# Altium schematic sheet 3KW-139_V1.2SchDoc.SchDoc
size A2
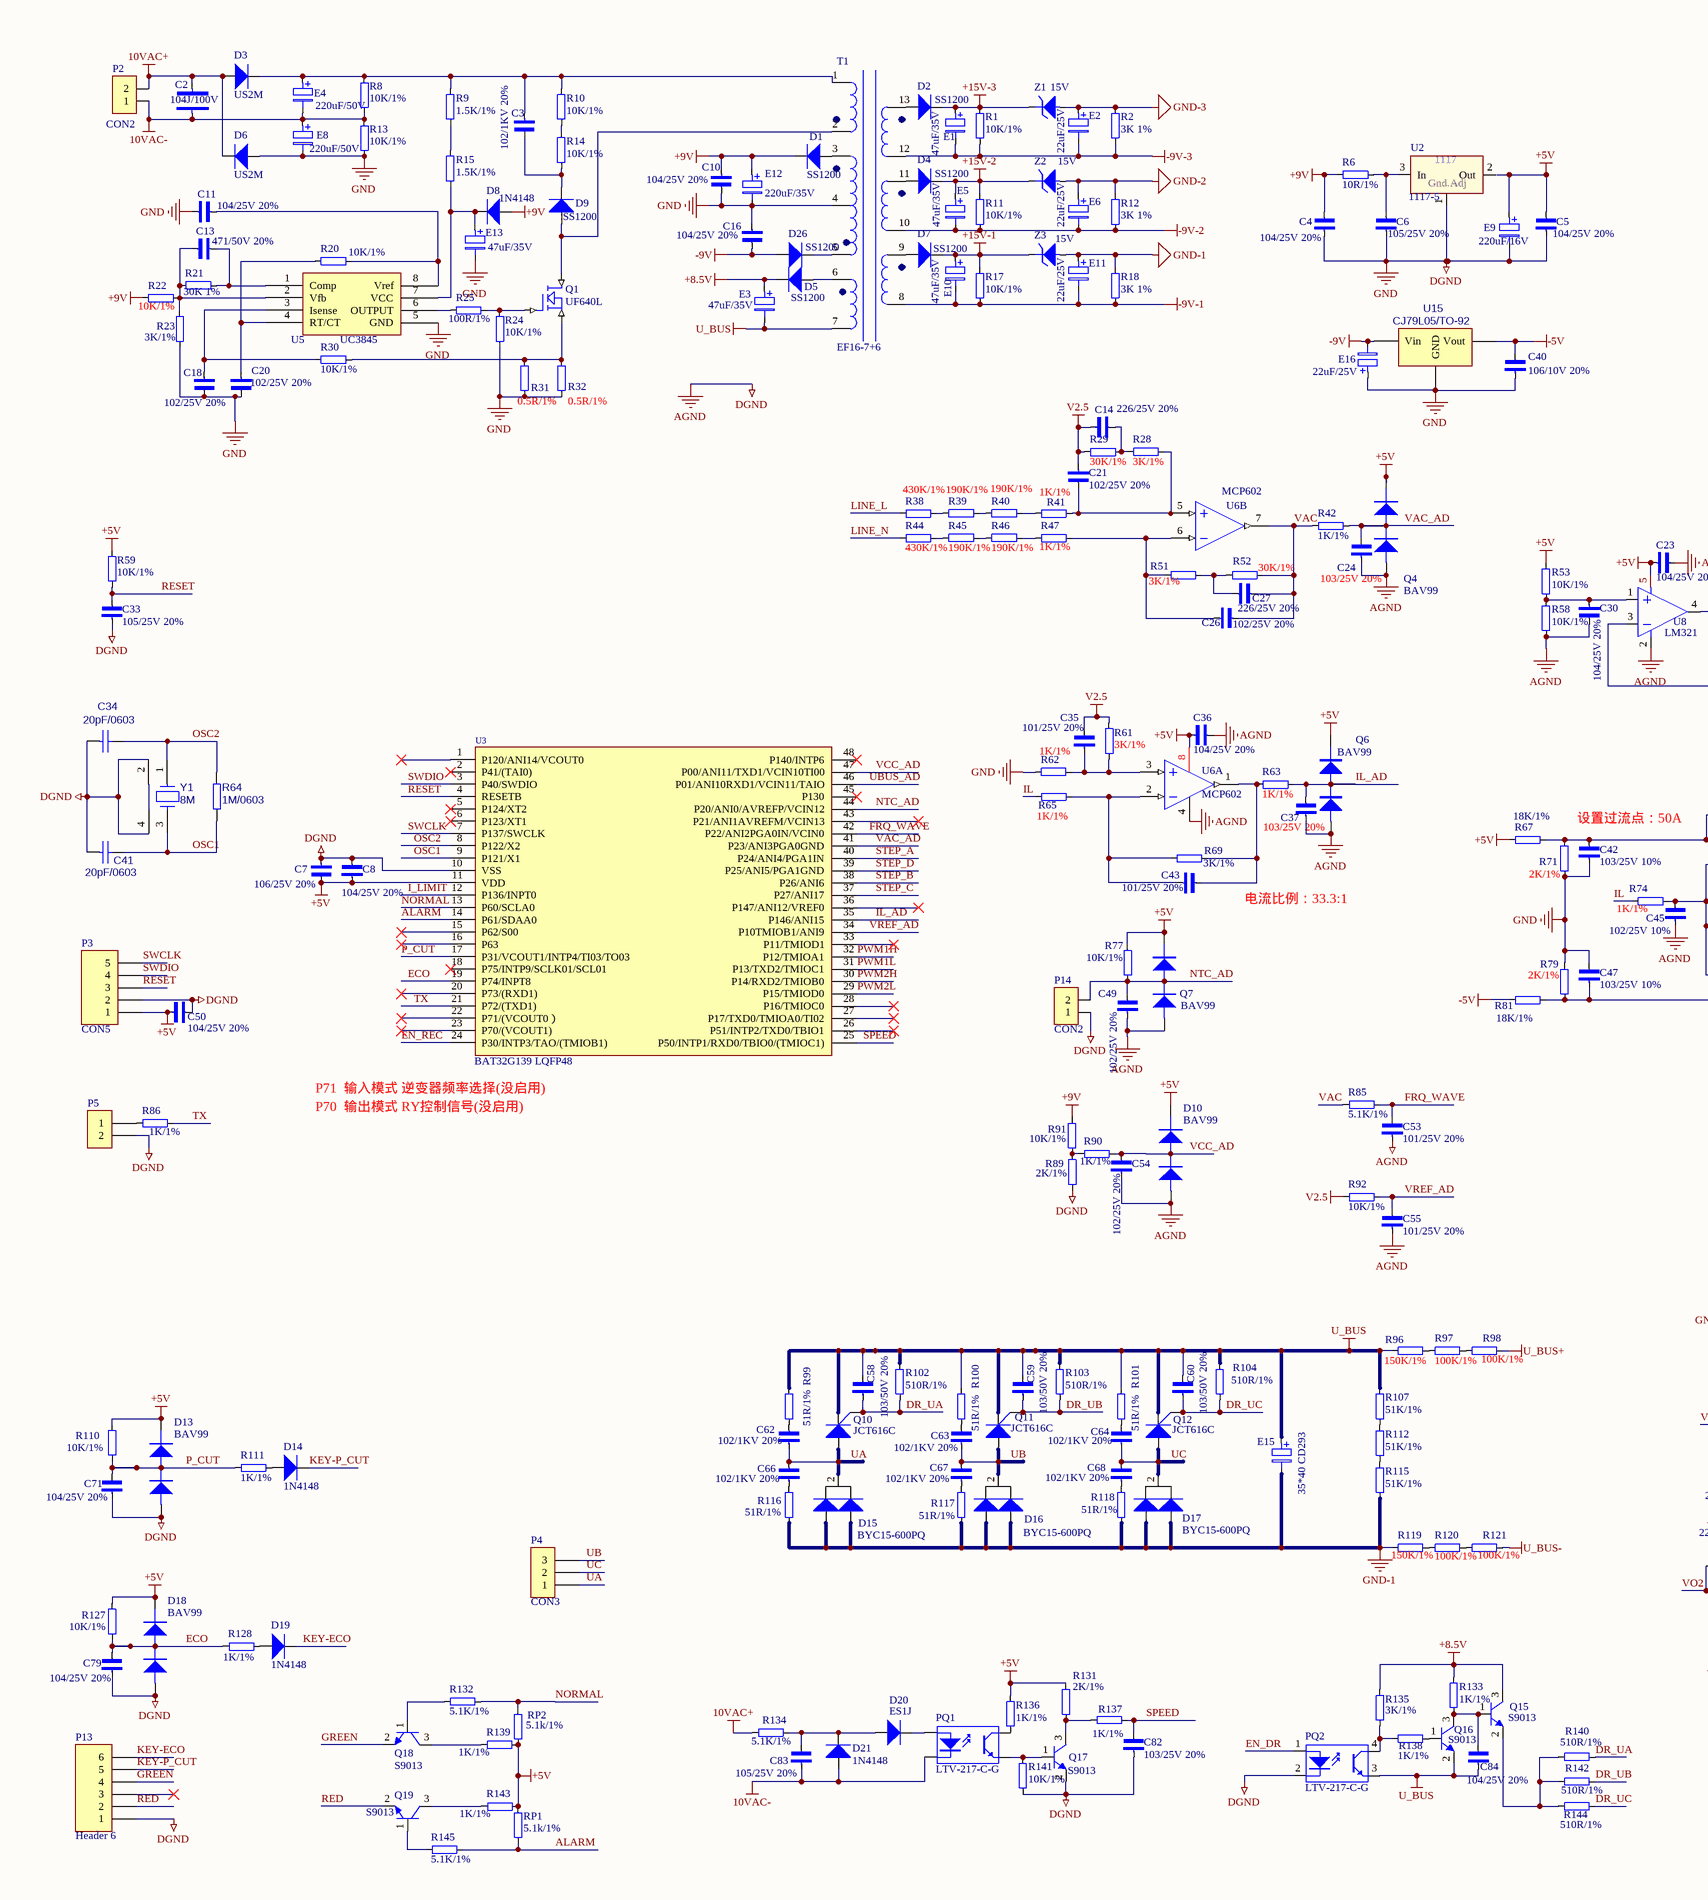
[diagram p0: 3KW-139_V1.2SchDoc.SchDoc, left]
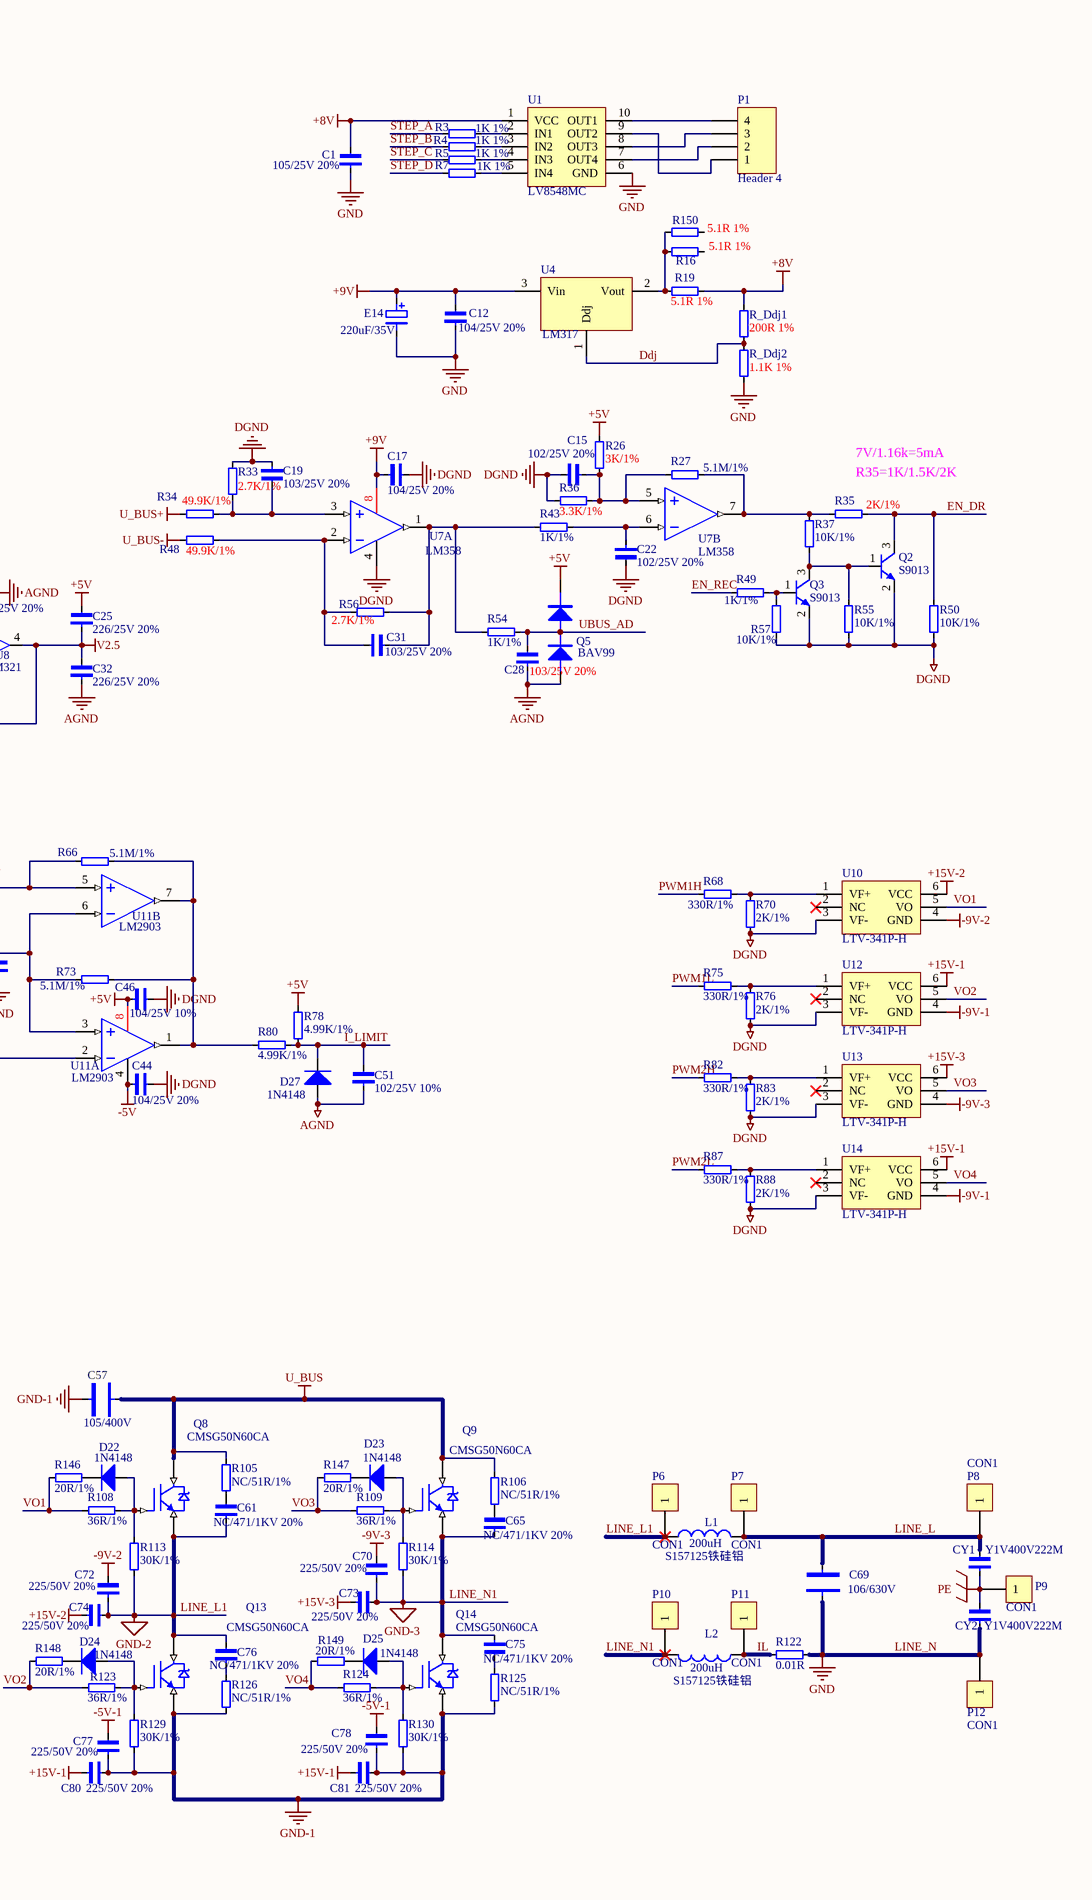
[diagram p1: 3KW-139_V1.2SchDoc.SchDoc, right]

## Parts
C1  105/25V 20%  [0603c]
C2  104J/100V  [104/100V]
C3  102/1KV 20%  [1206C]
C4  104/25V 20%  [0603c]
C5  104/25V 20%  [0603c]
C6  105/25V 20%  [0603c]
C7  106/25V 20%  [0603c]
C8  104/25V 20%  [0603c]
C10  104/25V 20%  [0603C]
C11  104/25V 20%  [0603C]
C12  104/25V 20%  [0603c]
C13  471/50V 20%  [0603C]
C14  226/25V 20%  [0603c]
C15  102/25V 20%  [0603c]
C16  104/25V 20%  [0603C]
C17  104/25V 20%  [0603c]
C18  102/25V 20%  [0603C]
C19  103/25V 20%  [0603c]
C20  102/25V 20%  [0603C]
C21  102/25V 20%  [0603c]
C22  102/25V 20%  [0603c]
C23  104/25V 20%  [0603c]
C24  103/25V 20%  [0603c]
C25  226/25V 20%  [0603c]
C26  102/25V 20%  [0603c]
C27  226/25V 20%  [0603c]
C28  103/25V 20%  [0603c]
C30  104/25V 20%  [0603c]
C31  103/25V 20%  [0603c]
C32  226/25V 20%  [0603c]
C33  105/25V 20%  [0603c]
C34  20pF/0603  [C0603]
C35  101/25V 20%  [0603c]
C36  104/25V 20%  [0603c]
C37  103/25V 20%  [0603c]
C40  106/10V 20%  [0603c]
C41  20pF/0603  [C0603]
C42  103/25V 10%  [0603c]
C43  101/25V 20%  [0603c]
C44  104/25V 20%  [0603c]
C45  102/25V 10%  [0603c]
C46  104/25V 10%  [0603c]
C47  103/25V 10%  [0603c]
C49  102/25V 20%  [0603c]
C50  104/25V 20%  [0603c]
C51  102/25V 10%  [0603c]
C53  101/25V 20%  [0603c]
C54  102/25V 20%  [0603C]
C55  101/25V 20%  [0603c]
C57  105/400V  [105/400V-3]
C58  103/50V 20%  [1206C]
C59  103/50V 20%  [1206C]
C60  103/50V 20%  [1206C]
C61  NC/471/1KV 20%  [1206C]
C62  102/1KV 20%  [1206C]
C63  102/1KV 20%  [1206C]
C64  102/1KV 20%  [1206C]
C65  NC/471/1KV 20%  [1206C]
C66  102/1KV 20%  [1206C]
C67  102/1KV 20%  [1206C]
C68  102/1KV 20%  [1206C]
C69  106/630V  [106/400V]
C70  225/50V 20%  [1206C]
C71  104/25V 20%  [0603C]
C72  225/50V 20%  [1206C]
C73  225/50V 20%  [1206C]
C74  225/50V 20%  [1206C]
C75  NC/471/1KV 20%  [1206C]
C76  NC/471/1KV 20%  [1206C]
C77  225/50V 20%  [1206C]
C78  225/50V 20%  [1206C]
C79  104/25V 20%  [0603C]
C80  225/50V 20%  [1206C]
C81  225/50V 20%  [1206C]
C82  103/25V 20%  [0603C]
C83  105/25V 20%  [1206C]
C84  104/25V 20%  [1206C]
CY1  Y1V400V222M  [Y1V400]
CY2  Y1V400V222M  [Y1V400]
D1  SS1200  [SMA - AK]
D2  SS1200  [SMA - AK]
D3  US2M  [SMA - AK]
D4  SS1200  [SMA - AK]
D5  SS1200  [SMA - AK]
D6  US2M  [SMA - AK]
D7  SS1200  [SMA - AK]
D8  1N4148  [SOD-123F]
D9  SS1200  [SMA - AK]
D10  BAV99  [SOT-23]
D13  BAV99  [SOT-23]
D14  1N4148  [SOD-123F]
D15  BYC15-600PQ  [TO-220-AC - S]
D16  BYC15-600PQ  [TO-220-AC - S]
D17  BYC15-600PQ  [TO-220-AC - S]
D18  BAV99  [SOT-23]
D19  1N4148  [SOD-123F]
D20  ES1J  [SOD-123F]
D21  1N4148  [SOD-123F]
D22  1N4148  [SOD-123F]
D23  1N4148  [SOD-123F]
D24  1N4148  [SOD-123F]
D25  1N4148  [SOD-123F]
D26  SS1200  [SMA - AK]
D27  1N4148  [SOD-123F]
E1  47uF/35V  [ECAP-6.3*11]
E2  22uF/25V  [ECAP-5*11]
E3  47uF/35V  [ECAP-6.3*11]
E4  220uF/50V  [10*16]
E5  47uF/35V  [ECAP-6.3*11]
E6  22uF/25V  [ECAP-5*11]
E8  220uF/50V  [10*16]
E9  220uF/16V  [6.3*11]
E10  47uF/35V  [ECAP-6.3*11]
E11  22uF/25V  [ECAP-5*11]
E12  220uF/35V  [8*12]
E13  47uF/35V  [ECAP-6.3*11]
E14  220uF/35V  [EC08F350]
E15  35*40 CD293  [1000uF/250V]
E16  22uF/25V  [ECAP-5*11]
L1  S157125铁硅铝  value 200uH  [L45*45-1-1]
L2  S157125铁硅铝  value 200uH  [L45*45-1-1]
P1  Header 4  [P4-2.8]
P2  CON2  [DJ7021A-2.8-11]
P3  CON5  [HDR1X5]
P4  CON3  [DJ3071A-6.3-11]
P5  (no value)  [HDR1X2]
P6  CON1  [HOLE1.0]
P7  CON1  [HOLE1.0]
P8  CON1  [HOLE2.5]
P9  CON1  [HOLE1.6]
P10  CON1  [HOLE1.0]
P11  CON1  [HOLE1.0]
P12  CON1  [HOLE2.5]
P13  Header 6  [P6-2.8]
P14  CON2  [HDR1X2]
PQ1  LTV-217-C-G  [SOP-4-P1.27]
PQ2  LTV-217-C-G  [SOP-4-P1.27]
Q1  UF640L  [TO-220]
Q2  S9013  [S8050]
Q3  S9013  [S8050]
Q4  BAV99  [SOT-23]
Q5  BAV99  [SOT-23]
Q6  BAV99  [SOT-23]
Q7  BAV99  [SOT-23]
Q8  CMSG50N60CA  [to-247-1-1]
Q9  CMSG50N60CA  [to-247-1-1]
Q10  JCT616C  [TO-220-AB1 - S]
Q11  JCT616C  [TO-220-AB1 - S]
Q12  JCT616C  [TO-220-AB1 - S]
Q13  CMSG50N60CA  [to-247-1-1]
Q14  CMSG50N60CA  [to-247-1-1]
Q15  S9013  [S8050]
Q16  S9013  [S8050]
Q17  S9013  [S8050]
Q18  S9013  [S8050]
Q19  S9013  [S8050]
R1  10K/1%  [0603R]
R2  3K 1%  [0603R]
R3  1K 1%  [0603R]
R4  1K 1%  [0603R]
R5  1K 1%  [0603R]
R6  10R/1%  [0603R]
R7  1K 1%  [0603R]
R8  10K/1%  [0603R]
R9  1.5K/1%  [1206R]
R10  10K/1%  [1206R]
R11  10K/1%  [0603R]
R12  3K 1%  [0603R]
R13  10K/1%  [0603R]
R14  10K/1%  [1206R]
R15  1.5K/1%  [1206R]
R16  5.1R 1%  [1206R]
R17  10K/1%  [0603R]
R18  3K 1%  [0603R]
R19  5.1R 1%  [1206R]
R20  10K/1%  [0603R]
R21  30K 1%  [0603R]
R22  10K/1%  [0603R]
R23  3K/1%  [0603R]
R24  10K/1%  [0603R]
R25  100R/1%  [0603R]
R26  3K/1%  [0603R]
R27  5.1M/1%  [0603R]
R28  3K/1%  [0603R]
R29  30K/1%  [0603R]
R30  10K/1%  [0603R]
R31  0.5R/1%  [1206R]
R32  0.5R/1%  [1206R]
R33  2.7K/1%  [0603R]
R34  49.9K/1%  [0603R]
R35  2K/1%  [0603R]
R36  3.3K/1%  [0603R]
R37  10K/1%  [0603R]
R38  430K/1%  [1206R]
R39  190K/1%  [1206R]
R40  190K/1%  [1206R]
R41  1K/1%  [0603R]
R42  1K/1%  [0603R]
R43  1K/1%  [0603R]
R44  430K/1%  [1206R]
R45  190K/1%  [1206R]
R46  190K/1%  [1206R]
R47  1K/1%  [0603R]
R48  49.9K/1%  [0603R]
R49  1K/1%  [0603R]
R50  10K/1%  [0603R]
R51  3K/1%  [0603R]
R52  30K/1%  [0603R]
R53  10K/1%  [0603R]
R54  1K/1%  [0603R]
R55  10K/1%  [0603R]
R56  2.7K/1%  [0603R]
R57  10K/1%  [0603R]
R58  10K/1%  [0603R]
R59  10K/1%  [0603R]
R61  3K/1%  [0603R]
R62  1K/1%  [0603R]
R63  1K/1%  [0603R]
R64  1M/0603  [R0603]
R65  1K/1%  [0603R]
R66  5.1M/1%  [0603R]
R67  18K/1%  [0603R]
R68  330R/1%  [0603R]
R69  3K/1%  [0603R]
R70  2K/1%  [0603R]
R71  2K/1%  [0603R]
R73  5.1M/1%  [0603R]
R74  1K/1%  [0603R]
R75  330R/1%  [0603R]
R76  2K/1%  [0603R]
R77  10K/1%  [0603R]
R78  4.99K/1%  [0603R]
R79  2K/1%  [0603R]
R80  4.99K/1%  [0603R]
R81  18K/1%  [0603R]
R82  330R/1%  [0603R]
R83  2K/1%  [0603R]
R85  5.1K/1%  [0603R]
R86  1K/1%  [0603R]
R87  330R/1%  [0603R]
R88  2K/1%  [0603R]
R89  2K/1%  [0603R]
R90  1K/1%  [0603R]
R91  10K/1%  [0603R]
R92  10K/1%  [0603R]
R96  150K/1%  [1206R]
R97  100K/1%  [1206R]
R98  100K/1%  [1206R]
R99  51R/1%  [1206R]
R100  51R/1%  [1206R]
R101  51R/1%  [1206R]
R102  510R/1%  [1206R]
R103  510R/1%  [1206R]
R104  510R/1%  [1206R]
R105  NC/51R/1%  [2512R]
R106  NC/51R/1%  [2512R]
R107  51K/1%  [1206R]
R108  36R/1%  [1206R]
R109  36R/1%  [1206R]
R110  10K/1%  [0603R]
R111  1K/1%  [0603R]
R112  51K/1%  [1206R]
R113  30K/1%  [0603R]
R114  30K/1%  [0603R]
R115  51K/1%  [1206R]
R116  51R/1%  [1206R]
R117  51R/1%  [1206R]
R118  51R/1%  [1206R]
R119  150K/1%  [1206R]
R120  100K/1%  [1206R]
R121  100K/1%  [1206R]
R122  0.01R  [0.01R 5WS 水泥电阻]
R123  36R/1%  [1206R]
R124  36R/1%  [1206R]
R125  NC/51R/1%  [2512R]
R126  NC/51R/1%  [2512R]
R127  10K/1%  [0603R]
R128  1K/1%  [0603R]
R129  30K/1%  [0603R]
R130  30K/1%  [0603R]
R131  2K/1%  [0603R]
R132  5.1K/1%  [0603R]
R133  1K/1%  [0603R]
R134  5.1K/1%  [0603R]
R135  3K/1%  [0603R]
R136  1K/1%  [0603R]
R137  1K/1%  [0603R]
R138  1K/1%  [0603R]
R139  1K/1%  [0603R]
R140  510R/1%  [1206R]
R141  10K/1%  [0603R]
R142  510R/1%  [1206R]
R143  1K/1%  [0603R]
R144  510R/1%  [1206R]
R145  5.1K/1%  [0603R]
R146  20R/1%  [1206R]
R147  20R/1%  [1206R]
R148  20R/1%  [1206R]
R149  20R/1%  [1206R]
R150  5.1R 1%  [1206R]
R_Ddj1  200R 1%  [0603R]
R_Ddj2  1.1K 1%  [0603R]
RP1  5.1k/1%  [0603R]
RP2  5.1k/1%  [0603R]
T1  EF16-7+6  [EF16-7+7]
U1  LV8548MC  [SOIC-10]
U2  1117-5  [SOT-223]
U3  BAT32G139 LQFP48  [LQFP-48]
U4  LM317  [TO-252(DPAK)]
U5  UC3845  [SOIC-8_150mil]
U6  MCP602  [SO-8]  (parts A,B of 2)
U7  LM358  [SO-8]  (parts A,B of 2)
U8  LM321  [SOT23-5]
U10  LTV-341P-H  [LSOP6]
U11  LM2903  [SO-8]  (parts A,B of 2)
U12  LTV-341P-H  [LSOP6]
U13  LTV-341P-H  [LSOP6]
U14  LTV-341P-H  [LSOP6]
U15  CJ79L05/TO-92  [TO-92 - 7915]
Y1  8M  [YY-1]
Z1  15V  [SOD-123]
Z2  15V  [SOD-123]
Z3  15V  [SOD-123]

## Nets
10VAC+: C2.2 D3.A D6.K P2.2 R134.1
10VAC-: C2.1 C83.1 D21.A E4.2 E8.1 P2.1 PQ1.2 R8.2 R13.1
+5V: C5.2 C7.2 C8.1 C23.2 C25.2 C36.1 C46.1 C50.1 D10.2 D13.2 D18.2 E9.1 P3.1 Q4.2 Q5.2 Q6.2 Q7.2 R26.1 R53.2 R59.1 R67.1 R77.1 R78.2 R110.1 R127.1 R131.2 R136.2 R139.1 R143.2 RP1.2 RP2.1 U3.11(VDD) U6.8(V+) U8.5 U11.8(V+)
+8.5V: D5.K E3.1 Q15.3(C) R133.2 R135.2
+8V: C1.2 R19.1 R_Ddj1.1 U1.1(VCC)
+9V: C4.2 C10.1 C12.2 C17.1 D1.K D8.A E12.1 E14.1 R6.2 R22.1 R91.2 U4.3(Vin) U7.8(V+)
+15V-1: C80.1 C81.1 D7.K E10.1 R17.1 U12.6(VCC) U14.6(VCC) Z3.K
+15V-2: C74.1 D4.K E5.1 R11.1 U10.6(VCC) Z2.K
+15V-3: C73.1 D2.K E1.1 R1.1 U13.6(VCC) Z1.K
-5V: C40.2 C44.1 R81.1 U11.4(V-) U15.3(Vout)
-5V-1: C77.2 C78.2
-9V: C16.2 D26.A E16.2 U15.2(Vin)
-9V-1: E10.2 E11.2 R17.2 R18.2 T1.8 U12.4(GND) U14.4(GND)
-9V-2: C72.2 E5.2 E6.2 R11.2 R12.2 T1.10 U10.4(GND)
-9V-3: C70.2 E1.2 E2.2 R1.2 R2.2 T1.12 U13.4(GND)
GND-1: C57.1 C77.1 C78.1 C80.2 C81.2 D15.1 D16.1 D17.1 E11.1 E15.2 Q13.S Q14.S R18.1 R115.1 R116.1 R117.1 R118.1 R119.2 R125.2 R126.1 R129.1 R130.1 Z3.A
LINE_L1: C61.1 C72.1 C74.2 C76.2 E6.1 L1.1 P6.1 Q8.S Q13.D R12.1 R113.1 Z2.A  [also labelled GND-2]
LINE_N: C1.1 C4.1 C5.1 C6.1 C7.1 C8.2 C10.2 C11.2 C12.1 C15.2 C16.1 C17.2 C18.2 C19.1 C20.2 C22.2 C23.1 C24.1 C28.1 C30.2 C32.1 C33.1 C34.1 C36.2 C37.1 C40.1 C41.1 C42.1 C44.2 C45.1 C46.2 C47.2 C49.1 C50.2 C51.1 C53.1 C54.1 C55.1 C69.1 C71.1 C79.1 C82.1 CY2.1 D6.A D10.1 D13.1 D18.1 D27.A E8.2 E9.2 E12.2 E13.2 E14.2 E16.1 P3.2 P5.2 P12.1 P13.1 P14.1 PQ2.2 Q2.2(E) Q3.2(E) Q4.1 Q5.1 Q6.1 Q7.1 Q17.2(E) R13.2 R23.2 R24.2 R31.2 R32.2 R33.1 R36.2 R44.1 R50.1 R55.1 R57.2 R58.1 R62.2 R70.1 R71.1 R76.1 R79.2 R83.1 R88.1 R89.2 R122.2 R141.1 R_Ddj2.2 T1.4 U1.6(GND) U2.1 U3.10(VSS) U5.5(GND) U6.4(V-) U7.4(V-) U8.2 U10.3(VF-) U12.3(VF-) U13.3(VF-) U14.3(VF-) U15.1(GND) Y1.2 Y1.4  [also labelled AGND, DGND, GND]
LINE_N1: C65.1 C70.1 C73.2 C75.1 E2.1 L2.2 P10.1 Q9.S Q14.D R2.1 R114.1 Z1.A  [also labelled GND-3]
PE: CY1.1 CY2.2 P9.1
U_BUS: C57.2 C58.2 C59.2 C60.2 C84.1 E3.2 E15.1 PQ2.3 Q8.D Q9.D Q10.K Q11.K Q12.K Q16.2(E) R96.2 R99.2 R100.2 R101.2 R102.2 R103.2 R104.2 R105.2 R106.2 R107.2 T1.7
U_BUS+: R34.1 R98.1
U_BUS-: R48.1 R121.1
V2.5: C14.1 C21.1 C25.1 C32.2 C35.2 R29.1 R61.1 R92.1 U8.3 U8.4
ALARM: R145.2 RP1.1 U3.14(P61/SDAA0)
Ddj: R_Ddj1.2 R_Ddj2.1 U4.1(Ddj)
DR_UA: C58.1 Q10.G R102.1 R140.1
DR_UB: C59.1 Q11.G R103.1 R142.1
DR_UC: C60.1 Q12.G R104.1 R144.1
ECO: C79.2 D18.3 R127.2 R128.1 U3.19(P74/INPT8)
EN_DR: PQ2.1 Q2.3(C) R35.1 R50.2
EN_REC: R49.2 U3.24(P30/INTP3/TAO/(TMIOB1))
FRQ_WAVE: C53.2 R85.2 U3.42(P22/ANI2PGA0IN/VCIN0)
GREEN: P13.4 Q18.2(E)
I_LIMIT: C51.2 D27.K R78.1 R80.2 U3.12(P136/INPT0)
IL: L2.1 P11.1 R65.1 R74.2 R122.1
IL_AD: C37.2 Q6.3 R63.2 U3.35(P146/ANI15)
KEY-ECO: D19.K P13.6
KEY-P_CUT: D14.K P13.5
LINE_L: C69.2 CY1.2 L1.2 P7.1 P8.1 R38.1
NORMAL: R132.1 RP2.2 U3.13(P60/SCLA0)
NTC_AD: C49.2 P14.2 Q7.3 R77.2 U3.44(P20/ANI0/AVREFP/VCIN12)
OSC1: C41.2 R64.2 U3.9(P121/X1) Y1.3
OSC2: C34.2 R64.1 U3.8(P122/X2) Y1.1
P_CUT: C71.2 D13.3 R110.2 R111.1 U3.17(P31/VCOUT1/INTP4/TI03/TO03)
PWM1H: R68.1 U3.32(P12/TMIOA1)
PWM1L: R75.1 U3.31(P13/TXD2/TMIOC1)
PWM2H: R82.1 U3.30(P14/RXD2/TMIOB0)
PWM2L: R87.1 U3.29(P15/TMIOD0)
RED: P13.2 Q19.2(E)
RESET: C33.2 P3.3 R59.2 U3.4(RESETB)
SPEED: C82.2 R137.1 U3.25(P50/INTP1/RXD0/TBIO0/(TMIOC1))
STEP_A: R3.1 U3.40(P24/ANI4/PGA1IN)
STEP_B: R4.1 U3.38(P26/ANI6)
STEP_C: R5.1 U3.37(P27/ANI17)
STEP_D: R7.1 U3.39(P25/ANI5/PGA1GND)
SWCLK: P3.5 U3.7(P137/SWCLK)
SWDIO: P3.4 U3.3(P40/SWDIO)
TX: R86.2 U3.21(P72/(TXD1))
UA: C62.1 C66.2 D15.2 P4.1 Q10.A
UB: C63.1 C67.2 D16.2 P4.3 Q11.A
UBUS_AD: C28.2 Q5.3 R54.2 U3.46(P01/ANI10RXD1/VCIN11/TAIO)
UC: C64.1 C68.2 D17.2 P4.2 Q12.A
VAC: C26.1 C27.1 R42.1 R52.2 R85.1 U6.7(OUT)
VAC_AD: C24.2 Q4.3 R42.2 U3.41(P23/ANI3PGA0GND)
VCC_AD: C54.2 D10.3 R90.2 U3.47(P00/ANI11/TXD1/VCIN10TI00)
VO1: R108.1 R146.1 U10.5(VO)
VO2: R123.1 R148.1 U12.5(VO)
VO3: R109.1 R147.1 U13.5(VO)
VO4: R124.1 R149.1 U14.5(VO)
VREF_AD: C55.2 R92.2 U3.34(P10TMIOB1/ANI9)
NetC3_1: C3.1 D3.K E4.1 R8.1 R9.2 R10.2 T1.1
NetC3_2: C3.2 D9.K R14.1
NetC6_2: C6.2 R6.1 U2.3(In)
NetC11_1: C11.1 R20.2 U5.8(Vref)
NetC13_1: C13.1 R21.2 R22.2 R23.1 U5.2(Vfb)
NetC13_2: C13.2 R21.1 U5.1(Comp)
NetC14_2: C14.2 R28.2 R29.2
NetC15_1: C15.1 R26.2 R27.2 R36.1 U7.5(IN+)
NetC18_1: C18.1 R30.1 U5.3(Isense)
NetC19_2: C19.2 R33.2 R34.2 U7.3(IN+)
NetC20_1: C20.1 R20.1 U5.4(RT/CT)
NetC21_2: C21.2 R28.1 R41.2 U6.5(IN+)
NetC22_1: C22.1 R43.1 U7.6(IN-)
NetC26_2: C26.2 R47.2 R51.1 U6.6(IN-)
NetC27_2: C27.2 R51.2 R52.1
NetC30_1: C30.1 R53.1 R58.2 U8.1
NetC31_1: C31.1 R43.2 R54.1 R56.1 U7.1(OUT)
NetC31_2: C31.2 R48.2 R56.2 U7.2(IN-)
NetC35_1: C35.1 R61.2 R62.1 U6.3(IN+)
NetC42_2: C42.2 R66.2 R67.2 R71.2 U11.5(IN+)
NetC43_1: C43.1 R63.1 R69.2 U6.1(OUT)
NetC43_2: C43.2 R65.2 R69.1 U6.2(IN-)
NetC45_2: C45.2 R73.2 R74.1 U11.3(IN+) U11.6(IN-)
NetC47_1: C47.1 R79.1 R81.2 U11.2(IN-)
NetC61_2: C61.2 R105.1
NetC62_2: C62.2 R99.1
NetC63_2: C63.2 R100.1
NetC64_2: C64.2 R101.1
NetC65_2: C65.2 R106.1
NetC66_1: C66.1 R116.2
NetC67_1: C67.1 R117.2
NetC68_1: C68.1 R118.2
NetC75_2: C75.2 R125.1
NetC76_1: C76.1 R126.2
NetC83_2: C83.2 D20.A D21.K R134.2
NetC84_2: C84.2 Q15.1(B) Q16.3(C) R133.1
NetD1_A: D1.A T1.3
NetD2_A: D2.A T1.13
NetD4_A: D4.A T1.11
NetD5_A: D5.A T1.6
NetD7_A: D7.A T1.9
NetD8_K: D8.K E13.1 R15.1 U5.7(VCC)
NetD9_A: D9.A Q1.2(D) T1.2
NetD14_A: D14.A R111.2
NetD19_A: D19.A R128.2
NetD20_K: D20.K PQ1.1
NetD22_A: D22.A Q8.G R108.2 R113.2
NetD22_K: D22.K R146.2
NetD23_A: D23.A Q9.G R109.2 R114.2
NetD23_K: D23.K R147.2
NetD24_A: D24.A Q13.G R123.2 R129.2
NetD24_K: D24.K R148.2
NetD25_A: D25.A Q14.G R124.2 R130.2
NetD25_K: D25.K R149.2
NetD26_K: D26.K T1.5
NetP1_1: P1.1 U1.9(OUT2)
NetP1_2: P1.2 U1.7(OUT4)
NetP1_3: P1.3 U1.8(OUT3)
NetP1_4: P1.4 U1.10(OUT1)
NetP5_1: P5.1 R86.1
NetPQ1_3: PQ1.3 Q17.1(B) R141.2
NetPQ1_4: PQ1.4 R136.1
NetPQ2_4: PQ2.4 R135.1 R138.1
NetQ1_1: Q1.1(G) R24.1 R25.2
NetQ1_3: Q1.3(S) R30.2 R31.1 R32.1
NetQ2_1: Q2.1(B) Q3.3(C) R37.2 R55.2
NetQ3_1: Q3.1(B) R49.1 R57.1
NetQ15_2: Q15.2(E) R140.2 R142.2 R144.2
NetQ16_1: Q16.1(B) R138.2
NetQ17_3: Q17.3(C) R131.1 R137.2
NetQ18_1: Q18.1(B) R132.2
NetQ18_3: Q18.3(C) R139.2
NetQ19_1: Q19.1(B) R145.1
NetQ19_3: Q19.3(C) R143.1
NetR3_2: R3.2 U1.2(IN1)
NetR4_2: R4.2 U1.3(IN2)
NetR5_2: R5.2 U1.4(IN3)
NetR7_2: R7.2 U1.5(IN4)
NetR9_1: R9.1 R15.2
NetR10_1: R10.1 R14.2
NetR16_2: R16.2 R19.2 R150.2 U4.2(Vout)
NetR25_1: R25.1 U5.6(OUTPUT)
NetR27_1: R27.1 R35.2 R37.1 U7.7(OUT)
NetR38_2: R38.2 R39.2
NetR39_1: R39.1 R40.2
NetR40_1: R40.1 R41.1
NetR44_2: R44.2 R45.2
NetR45_1: R45.1 R46.2
NetR46_1: R46.1 R47.1
NetR66_1: R66.1 R73.1 R80.1 U11.1(OUT) U11.7(OUT)
NetR68_2: R68.2 R70.2 U10.1(VF+)
NetR75_2: R75.2 R76.2 U12.1(VF+)
NetR82_2: R82.2 R83.2 U13.1(VF+)
NetR87_2: R87.2 R88.2 U14.1(VF+)
NetR89_1: R89.1 R90.1 R91.1
NetR96_1: R96.1 R97.2
NetR97_1: R97.1 R98.2
NetR107_1: R107.1 R112.2
NetR112_1: R112.1 R115.2
NetR119_1: R119.1 R120.2
NetR120_1: R120.1 R121.2

Not connected (* = marked no-connect by the designer): P13 3*; R16 1; R150 1; U2 2(Out); U3 1(P120/ANI14/VCOUT0)* 2(P41/(TAI0))* 5(P124/XT2)* 6(P123/XT1)* 15(P62/S00)* 16(P63)* 18(P75/INTP9/SCLK01/SCL01)* 20(P73/(RXD1))* 22(P71/(VCOUT0）)* 23(P70/(VCOUT1))* 26(P51/INTP2/TXD0/TBIO1)* 27(P17/TXD0/TMIOA0/TI02)* 28(P16/TMIOC0)* 33(P11/TMIOD1)* 36(P147/ANI12/VREF0)* 43(P21/ANI1AVREFM/VCIN13)* 45(P130)* 48(P140/INTP6)*; U10 2(NC)*; U12 2(NC)*; U13 2(NC)*; U14 2(NC)*

## Notes on the sheet
- (near R35) R35=1K/1.5K/2K
- 7V/1.16k=5mA
- 设置过流点：50A
- 电流比例：33.3:1
- (near U3) P71  输入模式 逆变器频率选择(没启用)
- P70  输出模式 RY控制信号(没启用)
- (in symbol 1117) Gnd.Adj

## Library data of the parts
C1 C3-C8 C10-C28 C30-C33 C35-C37 C40 C42-C47 C49-C51 C53-C55 C58-C68 C70-C84 CY1 CY2 = C_SMD: 贴片 无极性电容
C2 C57 C69 = CAPACITOR_CBB: CBB无极性电容
C34 C41 = CAP-SMD: Cap; Stuff: *; Capability: *; Voltage: *
  C41: Footprint: *
D1-D9 D14 D19-D27 = D_SMD: 贴片 二极管
D10 D13 D18 = D2-串联: 贴片串联双二极管 eg:BAT54S
D15-D17 = DIODE TO-220
E1-E6 E8-E14 E16 = E: 直插 电解电容
E15 = E: 直插 电解电容 35*40 CD293 / 120VAC=2200uF/250V / 230VAC=330uF/450V
L1 L2 = Inductor: Code_IEC: 1005; Published: 8-Jun-2000; LatestRevisionDate: 29-May-2009; LatestRevisionNote: IPC-7351 Footprint Added.; PackageReference: 0402-A; Publisher: Altium Limited; PackageDescription: Chip Inductor; Code_JEITA: 0402
P1 = Header 4: Header, 4-Pin; LatestRevisionDate: 17-Jul-2002; LatestRevisionNote: Re-released for DXP Platform.; Publisher: Altium Limited
P3 = Header 5: Header, 5-Pin; LatestRevisionDate: 17-Jul-2002; LatestRevisionNote: Re-released for DXP Platform.; Publisher: Altium Limited
P5 = CON2P: Connector, 2Pin
P13 = Header 6: Header, 5-Pin; LatestRevisionDate: 17-Jul-2002; LatestRevisionNote: Re-released for DXP Platform.; Publisher: Altium Limited
PQ1 PQ2 = OPTO-817: 光藕-PC817,PC357
Q1 = MOS-N: MOSFET
Q2 Q3 Q15-Q19 = S8050: NPN
Q8 Q9 Q13 Q14 = IGBT
Q10-Q12 = TYN625
R1-R59 R61-R63 R65-R71 R73-R83 R85-R92 R96-R150 R_Ddj1 R_Ddj2 RP1 RP2 = R_SMD: 贴片 电阻器
R64 = RES-SMD: SMD; Stuff: *
U2 = 1117: IC-1117系列稳压块
U3 = CMS32M5333&CMS32M5333L
U5 = LM3845
U6 U7 U11 = LM358: AMP 0.3V/uS
U15 = LM7905
Y1 = CRYSTAL_1
Z1-Z3 = ZD_SMD: 贴片 稳压二极管